# EAGLE design untitled 2 mask (EAGLE 7.4.0)
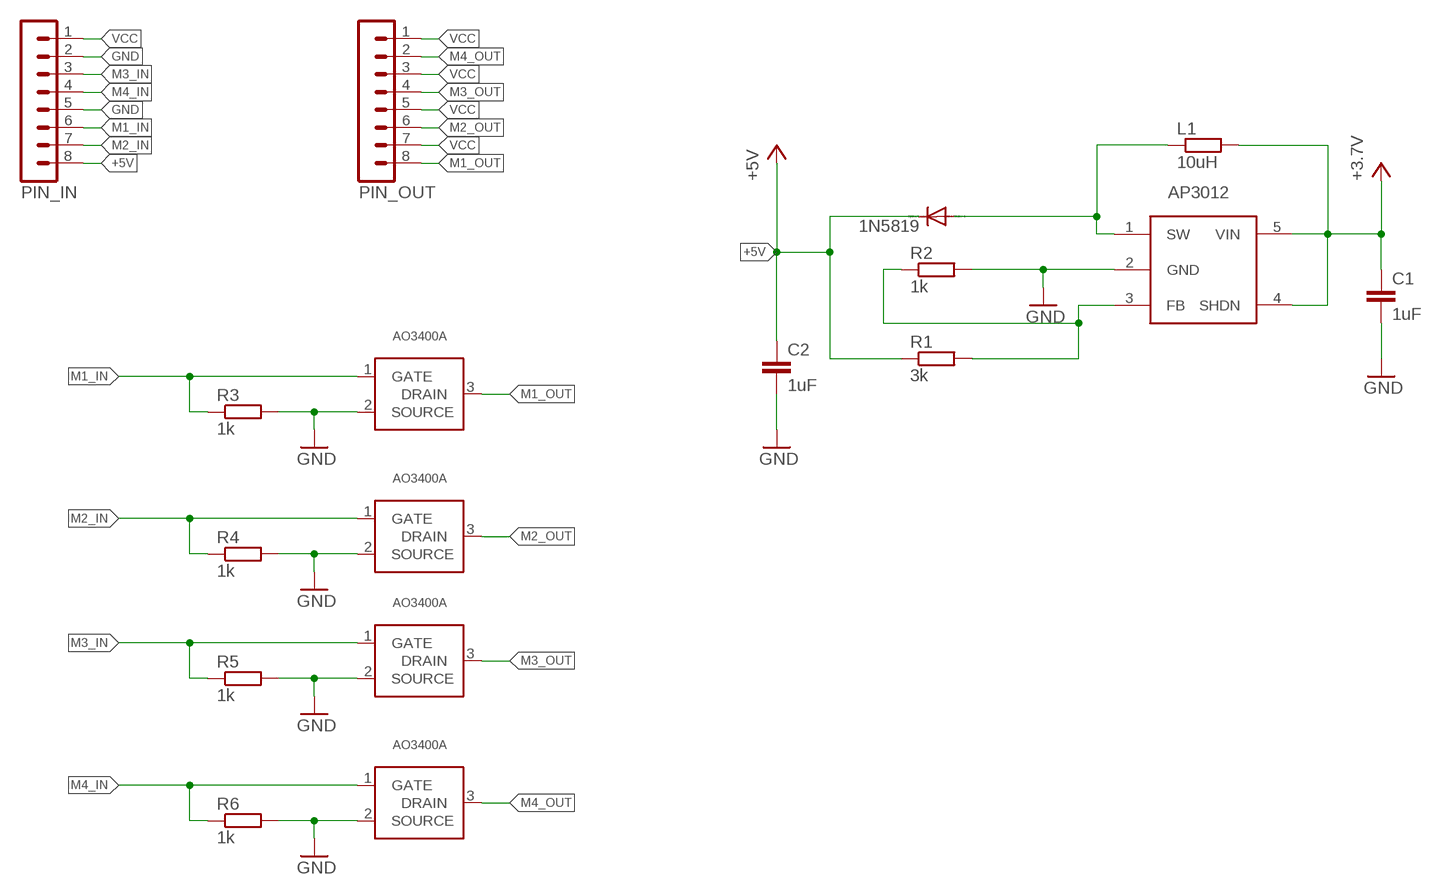
[diagram p0: schematic, sheet 1]

## Parts
1N5819  DIODE-DO214AC  [DO214AC]
C1  1uF  C-EUC1206  [C1206]
C2  1uF  C-EUC1206  [C1206]
L1  10uH  R-EU_R0805  [R0805]
MOSFET1  AO3400A  [SOT-23]
MOSFET2  AO3400A  [SOT-23]
MOSFET3  AO3400A  [SOT-23]
MOSFET4  AO3400A  [SOT-23]
PIN_IN  MA08-1  [MA08-1]
PIN_OUT  MA08-1  [MA08-1]
R1  3k  R-EU_R1206  [R1206]
R2  1k  R-EU_R1206  [R1206]
R3  1k  R-EU_R1206  [R1206]
R4  1k  R-EU_R1206  [R1206]
R5  1k  R-EU_R1206  [R1206]
R6  1k  R-EU_R1206  [R1206]
U$1  AP3012  [SOT-23-5]

## Nets
+5V: 1N5819.C C2.1 PIN_IN.8 R1.1
GND: C1.2 C2.2 MOSFET1.2(SOURCE) MOSFET2.2(SOURCE) MOSFET3.2(SOURCE) MOSFET4.2(SOURCE) PIN_IN.2 PIN_IN.5 R2.2 R3.2 R4.2 R5.2 R6.2 U$1.2(GND)
M1_IN: MOSFET1.1(GATE) PIN_IN.6 R3.1
M1_OUT: MOSFET1.3(DRAIN) PIN_OUT.8
M2_IN: MOSFET2.1(GATE) PIN_IN.7 R4.1
M2_OUT: MOSFET2.3(DRAIN) PIN_OUT.6
M3_IN: MOSFET3.1(GATE) PIN_IN.3 R5.1
M3_OUT: MOSFET3.3(DRAIN) PIN_OUT.4
M4_IN: MOSFET4.1(GATE) PIN_IN.4 R6.1
M4_OUT: MOSFET4.3(DRAIN) PIN_OUT.2
N$1: 1N5819.A L1.1 U$1.1(SW)
N$3: R1.2 R2.1 U$1.3(FB)
VCC: C1.1 L1.2 PIN_IN.1 PIN_OUT.1 PIN_OUT.3 PIN_OUT.5 PIN_OUT.7 U$1.4(SHDN) U$1.5(VIN) ; supply symbol labelled +3.7V

## Library data of the parts
1N5819 = diode:DIODE-: DIODE
C1 C2 = resistor:C-EU: CAPACITOR, European symbol
L1 R1-R6 = resistor:R-EU_: RESISTOR, European symbol
MOSFET1-MOSFET4 = smd-footprints:AO3400A
PIN_IN PIN_OUT = con-lstb:MA08-1: PIN HEADER; OC_FARNELL: unknown; OC_NEWARK: unknown
U$1 = smd-footprints:AP3012

## Board
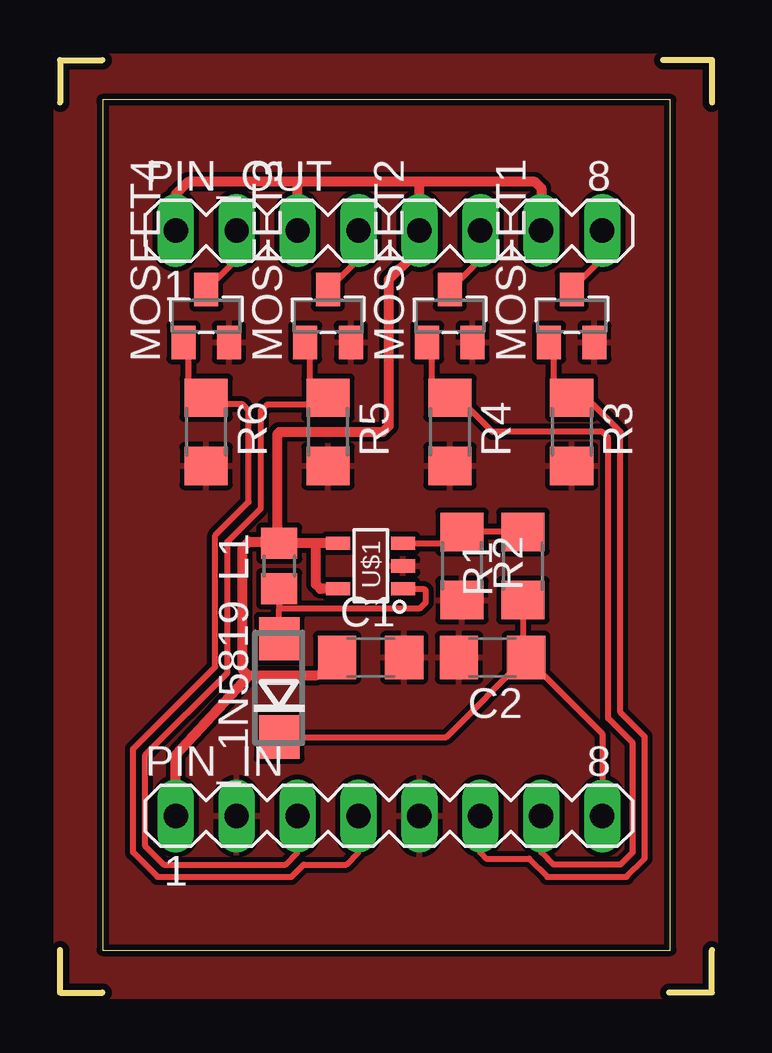
[diagram p1: board, top side]

Size 27.18 x 38.86 mm. Coordinates in mm from the lower left corner, seen from the top.
Outline: 27.18,1.78 27.18,0 25.4,0
Outline: 1.78,0 0,0 0,1.78
Outline: 0,37.08 0,38.86 1.78,38.86
Outline: 25.15,38.86 27.18,38.86 27.18,37.08
Outline: 1.78,1.78 25.45,1.78 25.45,37.2 1.78,37.2 1.78,37.08 1.78,1.78
Copper layers (1*16): Top 0.035mm / dielectric 1.5mm / Bottom 0.035mm
Design rules "default *": minimum track width 10mil, minimum drill 24mil, track to track 8mil, track to pad 8mil, pad to pad 8mil, via to via 8mil, smd to smd 8mil, copper to edge 10mil, drill to drill 8mil, minimum pad ring 10mil, minimum via ring 8mil, stop-mask expansion 4mil, vias tented up to drill 0mil, thermal gap 10mil

### Footprints (pad centres in the part's own frame; a part is rotated, then mirrored left to right if it is on the bottom)
DO214AC = smd 1.8 x 1.7: A 2.05,0; C -2.05,0
C1206 = smd 1.6 x 1.8: 1 -1.4,0; 2 1.4,0
R0805 = smd 1.3 x 1.5: 1 -0.95,0; 2 0.95,0
SOT-23 = smd 1 x 1.4: 1 -0.95,-1.1; 2 0.95,-1.1; 3 0,1.1
MA08-1 = drill 1.016 long: 1 -8.89,0; 2 -6.35,0; 3 -3.81,0; 4 -1.27,0; 5 1.27,0; 6 3.81,0; 7 6.35,0; 8 8.89,0
R1206 = smd 1.6 x 1.803: 1 -1.422,0; 2 1.422,0
SOT-23-5 = smd 1 x 0.55: 1 -1.35,0.95; 2 -1.35,0; 3 -1.35,-0.95; 4 1.35,-0.95; 5 1.35,0.95

### Placement (x,y rotation side)
1N5819  9.14,12.7 90 top
C1  12.95,13.97 0 top
C2  18.03,13.97 180 top
L1  9.14,17.78 90 top
MOSFET1  21.34,28.19 0 top
MOSFET2  16.26,28.19 0 top
MOSFET3  11.18,28.19 0 top
MOSFET4  6.1,28.19 0 top
PIN_IN  13.72,7.37 0 top
PIN_OUT  13.72,31.75 0 top
R1  19.3,17.78 90 top
R2  16.76,17.78 270 top
R3  21.34,23.37 270 top
R4  16.26,23.37 270 top
R5  11.18,23.37 270 top
R6  6.1,23.37 270 top
U$1  12.95,17.78 180 top

### Tracks (layer width: path | path; a pad name or v marks a point on that pad's centre or on a via)
+5V
  Top 0.254: R1.1 19.3,14.1 C2.1 | C2.1 22.61,10.8 PIN_IN.8 | 1N5819.C 16.11,10.65 C2.1
GND
  Top 0.254: MOSFET3.2 12.28,27.09 | MOSFET2.2 17.36,27.09 | MOSFET1.2 22.44,27.09 | 16.26,16.76 16.36,16.76 R2.2 | R5.2 11.4,21.95 | R4.2 16.61,21.95
  pour Top (isolate 0.254): 0,38.86 27.18,38.86 27.18,0 0,0
M1_IN
  Top 0.254: MOSFET1.1 20.57,27.09 20.57,24.77 21.34,24.77 R3.1 21.49,24.64 22.1,24.64 23.37,23.37 23.37,11.68 24.38,10.67 24.38,5.59 23.62,4.83 20.32,4.83 19.56,5.59 17.78,5.59 17.53,5.84 PIN_IN.6
M1_OUT
  Top 0.254: MOSFET1.3 21.34,29.34 22.61,30.61 PIN_OUT.8
M2_IN
  Top 0.254: MOSFET2.1 15.49,27.09 15.49,24.77 16.26,24.77 R4.1 16.41,24.64 16.76,24.64 18.03,23.37 22.61,23.37 22.86,23.11 22.86,11.43 23.88,10.41 23.88,5.84 23.37,5.33 20.57,5.33 20.07,5.84 PIN_IN.7
M2_OUT
  Top 0.254: MOSFET2.3 17.53,30.56 PIN_OUT.6
M3_IN
  Top 0.254: R5.1 11.15,24.77 10.41,24.77 10.41,27.09 MOSFET3.1 | 11.02,24.64 R5.1 | PIN_IN.3 9.91,5.84 9.4,5.33 4.32,5.33 3.56,6.1 3.56,9.91 6.99,13.34 6.99,18.8 8.38,20.19 8.38,24.26 8.64,24.51 10.9,24.51 R5.1
M3_OUT
  Top 0.254: MOSFET3.3 12.45,30.56 PIN_OUT.4
M4_IN
  Top 0.254: MOSFET4.1 5.33,27.09 5.33,24.77 6.07,24.77 R6.1 6.38,24.51 7.62,24.51 7.87,24.26 7.87,20.45 6.48,19.05 6.48,13.59 3.05,10.16 3.05,5.84 4.06,4.83 9.65,4.83 10.16,5.33 11.94,5.33 12.45,5.84 PIN_IN.4
M4_OUT
  Top 0.254: MOSFET4.3 7.37,30.56 PIN_OUT.2
N$1
  Top 0.254: U$1.1 15.17,16.83 15.24,16.76 15.24,16.26 14.99,16 9.14,16 | L1.1 9.14,16 | 1N5819.A 9.14,16
N$2
  pour Top: -0.25,39.12 27.43,39.12 27.43,-0.25 -0.25,-0.25
N$3
  Top 0.254: R1.2 R2.1 16.29,18.73 U$1.3
VCC
  Top 0.254: C1.1 11.43,13.97 10.67,13.21 | 9.08,18.8 L1.2 | 9.08,23.3 9.14,23.37
  Top 0.406: PIN_OUT.1 4.83,33.27 5.33,33.78 9.91,33.78 | PIN_OUT.7 20.07,33.53 19.81,33.78 14.99,33.78 | PIN_OUT.3 9.91,33.78 | U$1.4 10.67,18.73 | 10.67,18.73 L1.2 | U$1.5 10.86,16.83 10.67,17.02 10.67,18.73 | 10.67,13.21 7.87,13.21 | 7.87,13.21 7.62,13.46 7.62,18.54 7.87,18.8 9.08,18.8 9.08,23.3 | PIN_IN.1 4.83,9.91 7.87,13.21 | 9.14,23.37 13.46,23.37 13.72,23.62 13.72,29.72 14.73,30.73 14.73,31.5 PIN_OUT.5 14.99,32.77 14.99,33.53 14.99,33.78 | 14.99,33.78 9.91,33.78

### Text on the board
Description: VCC | M4 / OUT | VCC | M3 / OUT | VCC | M2 / OUT | VCC | M1 / OUT | PODLEWACZ / ⓒSh4DoV | 3.7V | GND | M3 / IN | M4 / IN | GND | M1 / IN | M2 / IN | 5V / OUT